# Altium project Drum_Water_Op3.PrjPcb (part 2 of 2)

## Sheet Power_Supply_AC_to_DC.SchDoc
size A; SheetNumber: 7; SheetTotal: 8
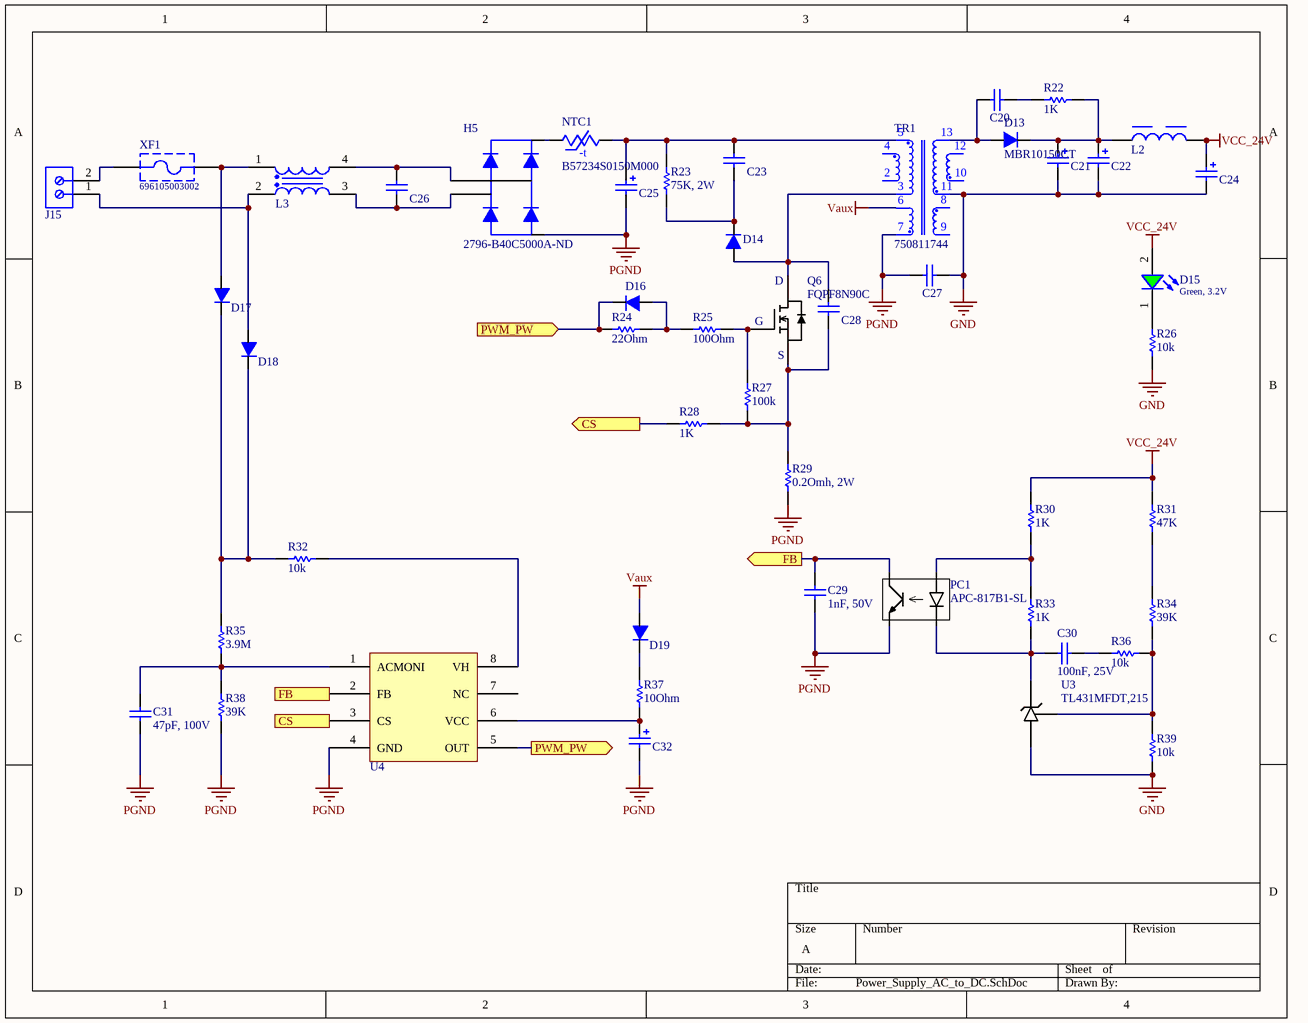
[diagram p6: Power_Supply_AC_to_DC.SchDoc]

### Parts
C20  1nF  [WCAP-CSMH_0805_L2W1.25H0.8_Reflow]  (value not drawn)
C21  1200uF  [WCAP-ATG8_D16H31.5]  (value not drawn)
C22  1200uF  [WCAP-ATG8_D16H31.5]  (value not drawn)
C23  4.7nF  [WCAP-CSMH_1206_L3.2W1.6H1.25]  (value not drawn)
C24  100uF  [WCAP-ATG8_D8H11.5]  (value not drawn)
C25  220uF  [WCAP-AI3H_D22H50]  (value not drawn)
C26  2.2uF  [WCAP-FTX2_L26W15H25]  (value not drawn)
C27  2.2nF  [WCAP-CSSA_2211_L5.7W2.8H2.5]  (value not drawn)
C28  22pF  [WCAP-CSMH_1210_L3.2W2.5H0.95]  (value not drawn)
C29  1nF, 50V  [WCAP-CSGP_0805_H=0.8mm_Reflow]
C30  100nF, 25V  [WCAP-CSGP_0805_H=0.8mm_Reflow]
C31  47pF, 100V  [WCAP-CSGP_0805_H=0.6mm_Reflow]
C32  10uF  [WCAP-ATG8_D5H11]  (value not drawn)
D13  MBR10150CT  [MBR10150CT]
D14  RS1M-13-F  [SMA]  (value not drawn)
D15  Green, 3.2V  [WL-SMCW_0603_H=0.7mm]
D16  CDBA360-HF  [SMA]  (value not drawn)
D17  RFU02VSM8STR  [Flat Lead]  (value not drawn)
D18  RFU02VSM8STR  [Flat Lead]  (value not drawn)
D19  RS1M-13-F  [SMA]  (value not drawn)
H5  2796-B40C5000A-ND  [GBJ-4]
J15  691137710002  [691137710002]  (value not drawn)
L2  10µH, 7A  [WE-LHMI_1040]  (value not drawn)
L3  13mH  [WE-FC_UT20V]  (value not drawn)
NTC1  B57234S0150M000  [NTC]
PC1  APC-817B1-SL  [APC-817B1-SL]
Q6  FQPF8N90C  [FQPF8N90C]
R22  value 1K  [RES-SM-2512]  (hidden comment: RK73H3ATTE10R0D)
R23  value 75K, 2W  [RES-SM-2512]  (hidden comment: 352175KFT)
R24  value 22Ohm  [RES-SM-0805]  (hidden comment: RK73H2ATTD22R0F)
R25  value 100Ohm  [RES-SM-0805]  (hidden comment: RK73B2ATTD101J)
R26  value 10k  [RES-SM-0805]  (hidden comment: RK73H2ATTD1002F)
R27  value 100k  [RES-SM-0805]  (hidden comment: RK73H2ATTD1003F)
R28  value 1K  [RES-SM-0805]  (hidden comment: RK73B2ATTD102J)
R29  value 0.2Omh, 2W  [RES-SM-2010]  (hidden comment: WFMB2010R2000FEA)
R30  value 1K  [RES-SM-0805]  (hidden comment: RK73B2ATTD102J)
R31  value 47K  [RES-SM-0805]  (hidden comment: RK73B2ATTD473J)
R32  value 10k  [RES-SM-0805]  (hidden comment: RK73H2ATTD1002F)
R33  value 1K  [RES-SM-0805]  (hidden comment: RK73B2ATTD102J)
R34  value 39K  [RES-SM-0805]  (hidden comment: RK73B2ATTD393J)
R35  value 3.9M  [RES-SM-0805]  (hidden comment: RK73B2ATTD395J)
R36  value 10k  [RES-SM-0805]  (hidden comment: RK73H2ATTD1002F)
R37  value 10Ohm  [RES-SM-0805]  (hidden comment: RK73H2ATTD10R0F)
R38  value 39K  [RES-SM-0805]  (hidden comment: RK73B2ATTD393J)
R39  value 10k  [RES-SM-0805]  (hidden comment: RK73H2ATTD1002F)
TR1  750811744  [750811744]
U3  TL431MFDT,215  [TO-236AB]
U4  BM1P061FJ-E2  [SOP-J8]  (value not drawn)
XF1  696105003002  [696105003002]

### Ports
CS (in), CS (out), FB (in), FB (out), PWM_PW (in), PWM_PW (out)

### Nets
GND: C21.2(N) C22.2(N) C24.2(N) C27.1 R26.2 R39.2 TR1.11 U3.3
PGND: C25.2(N) C27.2 C29.1 C31.1 C32.2(N) H5.4(-) PC1.3 R29.1 R38.1 TR1.7 U4.4(GND)
Vaux: D19.1(A) TR1.6
VCC_24V: C24.1(P) D15.2(A) L2.2 R30.1 R31.2
NetC20_1: C20.1 D13.1(A) TR1.13
NetC20_2: C20.2 R22.1
NetC21_1: C21.1(P) C22.1(P) D13.2(K) L2.1 R22.2
NetC23_1: C23.1 D14.2(K) R23.1
NetC23_2: C23.2 C25.1(P) NTC1.2 R23.2 TR1.5
NetC26_1: C26.1 H5.3 L3.3
NetC26_2: C26.2 H5.2 L3.4
NetC28_1: C28.1 Q6.3(S) R27.1 R28.1 R29.2
NetC28_2: C28.2 D14.1(A) Q6.2(D) TR1.3
NetC29_2: C29.2 PC1.4 U4.2(FB) ; port FB
NetC30_1: C30.1 PC1.2 R33.2 U3.1
NetC30_2: C30.2 R36.1
NetC31_2: C31.2 R35.1 R38.2 U4.1(ACMONI)
NetC32_1: C32.1(P) R37.1 U4.6(VCC)
NetD15_1: D15.1(K) R26.1
NetD16_1: D16.1(A) R24.2 R25.1
NetD16_2: D16.2(K) R24.1 U4.5(OUT) ; port PWM_PW
NetD17_1: D17.1(A) L3.1 XF1.2
NetD17_2: D17.2(K) D18.2(K) R32.2 R35.2
NetD18_1: D18.1(A) J15.1 L3.2
NetD19_2: D19.2(K) R37.2
NetH5_1: H5.1(+) NTC1.1
NetJ15_2: J15.2 XF1.1
NetPC1_1: PC1.1 R30.2 R33.1
NetQ6_1: Q6.1(G) R25.2 R27.2
NetR28_2: R28.2 U4.3(CS) ; port CS
NetR31_1: R31.1 R34.2
NetR32_1: R32.1 U4.8(VH)
NetR34_1: R34.1 R36.2 R39.1 U3.2

Not connected (* = marked no-connect by the designer): TR1 2 4 8 9 10 12; U4 7(NC)

### Notes on the sheet
- (in symbol NTC) -t

### Library data of the parts
C20 = 885342207013: WCAP-CSMH Multilayer Ceramic Chip Capacitor, Mid and High Voltage, size 0805, X7R Class II, 1nF, 500; Manufacturer: Wurth Elektronik; Case/Size Code: 0805; Capacitance Tolerance: 10%; Dissipation Factor: 2.5%; Insulation Resistance: 10GΩ; Rated Voltage (DC): 500V; Technical Reference: X7R0805102K500DFCT10000; No. Pad (SMD): 2; No. Pad (THT): 0; ComponentLink1Description: Website Link; ComponentLink1URL: https://www.we-online.com/redexpert/article/885342207013?ad; ComponentLink2Description: Datasheet Link; ComponentLink2URL: https://www.we-online.com/redexpert/spec/885342207013?ad; Manufacturer Part Number: 885342207013; Category: Multilayer Ceramic Chip Capacitors; Match Code: WCAP-CSMH; Mount: Surface Mount; Operating Temperature Max: 125°C; Operating Temperature Min: -55°C; Packaging: Tape and Reel; Length: 2mm; Width: 1.25mm; Height: 0.8mm; Capacitance: 1nF; Ceramic Type: X7R Class II; Unit Price (Digikey): 0.1
C21 C22 = 860010780025: WCAP-ATG8 Aluminum Electrolytic Capacitor, Radial THT, D16xH31.5mm, 1200uF, 63V; Manufacturer: Wurth Elektronik; Capacitance Tolerance: +/-20%; Dissipation Factor: 9%; Endurance: 2000h; Leakage Current: 756uA; Ripple Current: 1837mA; Technical Reference: ATBK315122M063DSPADB000; No. Pad (SMD): 0; No. Pad (THT): 2; ComponentLink1Description: Manufacturer Link; ComponentLink1URL: https://www.we-online.com/redexpert/article/860010780025?ad; ComponentLink2Description: Datasheet; ComponentLink2URL: https://www.we-online.com/redexpert/spec/860010780025?ad; Category: Aluminum Electrolytic Capacitors; Match Code: WCAP-ATG8; Manufacturer Part Number: 860010780025; Mount: Through Hole; Operating Temperature Max: 85°C; Operating Temperature Min: -40°C; Packaging: Ammo Pack; Height: 31.5mm; Diameter: 16mm; Capacitance: 1200uF; Rated Voltage (DC): 63V; Unit Price (Digikey): 2.81
C23 = 885342208008: WCAP-CSMH Multilayer Ceramic Chip Capacitor, Mid and High Voltage, size 1206, X7R Class II, 4.7nF, 5; Manufacturer: Wurth Elektronik; Case/Size Code: 1206; Capacitance Tolerance: 10%; Dissipation Factor: 2.5%; Insulation Resistance: 10GΩ; Rated Voltage (DC): 500V; Technical Reference: X7R1206472K500DFCT10000; No. Pad (SMD): 2; No. Pad (THT): 0; ComponentLink1Description: Website Link; ComponentLink1URL: https://www.we-online.com/redexpert/article/885342208008?ad; ComponentLink2Description: Datasheet Link; ComponentLink2URL: https://www.we-online.com/redexpert/spec/885342208008?ad; Manufacturer Part Number: 885342208008; Category: Multilayer Ceramic Chip Capacitors; Match Code: WCAP-CSMH; Mount: Surface Mount; Operating Temperature Max: 125°C; Operating Temperature Min: -55°C; Packaging: Tape and Reel; Length: 3.2mm; Width: 1.6mm; Height: 1.25mm; Capacitance: 4.7nF; Ceramic Type: X7R Class II; Unit Price (Digikey): 0.14
C24 = 860010674014: WCAP-ATG8 Aluminum Electrolytic Capacitor, Radial THT, D8xH11.5mm, 100uF, 50V; Manufacturer: Wurth Elektronik; Capacitance Tolerance: +/-20%; Dissipation Factor: 10%; Endurance: 2000h; Leakage Current: 50uA; Ripple Current: 286mA; Technical Reference: ATBE115101M050DSPA7B000; No. Pad (SMD): 0; No. Pad (THT): 2; ComponentLink1Description: Manufacturer Link; ComponentLink1URL: https://www.we-online.com/redexpert/article/860010674014?ad; ComponentLink2Description: Datasheet; ComponentLink2URL: https://www.we-online.com/redexpert/spec/860010674014?ad; Category: Aluminum Electrolytic Capacitors; Match Code: WCAP-ATG8; Manufacturer Part Number: 860010674014; Mount: Through Hole; Operating Temperature Max: 85°C; Operating Temperature Min: -40°C; Packaging: Ammo Pack; Height: 11.5mm; Diameter: 8mm; Capacitance: 100uF; Rated Voltage (DC): 50V; Unit Price (Digikey): 0.28
C25 = 861141483007: WCAP-AI3H Aluminum Electrolytic Capacitor, Snap-In, D22xH50mm, 220uF, 450V; Manufacturer: Wurth Elektronik; Capacitance Tolerance: +/-20%; Dissipation Factor: 20%; Endurance: 3000h; Leakage Current: 943.93uA; Ripple Current: 1000mA; Technical Reference: ANJN500221M450DSIC3C000; No. Pad (SMD): 0; No. Pad (THT): 2; ComponentLink1Description: Manufacturer Link; ComponentLink1URL: https://www.we-online.com/redexpert/article/861141483007?ad; ComponentLink2Description: Datasheet; ComponentLink2URL: https://www.we-online.com/redexpert/spec/861141483007?ad; Category: Aluminum Electrolytic Capacitors; Match Code: WCAP-AI3H; Manufacturer Part Number: 861141483007; Mount: Through Hole; Operating Temperature Max: 105°C; Operating Temperature Min: -25°C; Packaging: Tray; Height: 50mm; Diameter: 22mm; Capacitance: 220uF; Rated Voltage (DC): 450V; Unit Price (Digikey): 9.35
C26 = 890324026034: WCAP-FTX2 Film Capacitor, THT, L26W15H25mm, 2.2uF, 275VAC; Manufacturer: Wurth Elektronik; Capacitance Tolerance: +/-10%; Dissipation Factor @1kHz: 0.1%; Dissipation Factor @10kHz: 0.7%; Insulation Resistance: 10000Ohm x F; Pitch: 22.5mm; Rate of Voltage Rise: 170V/us; Rated Voltage (AC): 275V; Technical Reference: MX2P225225K275ASPB46000; No. Pad (SMD): 0; No. Pad (THT): 2; ComponentLink1Description: Manufacturer Link; ComponentLink1URL: https://www.we-online.com/redexpert/article/890324026034?ad; ComponentLink2Description: Datasheet; ComponentLink2URL: https://www.we-online.com/redexpert/spec/890324026034?ad; Category: Film Capacitors; Match Code: WCAP-FTX2; Manufacturer Part Number: 890324026034; Mount: Through Hole; Operating Temperature Max: 105°C; Operating Temperature Min: -40°C; Packaging: Carton; Length: 26mm; Width: 15mm; Height: 25mm; Capacitance: 2.2uF; Unit Price (Digikey): 3.2
C27 = 8853522130151: WCAP-CSSA Multilayer Ceramic Chip Safety Capacitor, 2211, X7R Class II, X1/Y2, 2.2nF, 250VAC; Manufacturer: Wurth Elektronik; Case/Size Code: 2211; Capacitance Tolerance: +/-10%; Dissipation Factor: 2.5%; Impulse Voltage: 5000VDC; Insulation Resistance: 10GOhm; Rated Voltage (AC): 250V; Technical Reference: X7R2211222KE00IFCT1B000; No. Pad (SMD): 2; No. Pad (THT): 0; ComponentLink1Description: Manufacturer Link; ComponentLink1URL: https://www.we-online.com/redexpert/article/8853522130151?ad; ComponentLink2Description: Datasheet; ComponentLink2URL: https://www.we-online.com/redexpert/spec/8853522130151?ad; Category: Multilayer Ceramic Chip Capacitors; Match Code: WCAP-CSSA; Manufacturer Part Number: 8853522130151; Mount: Surface Mount; Operating Temperature Max: 125°C; Operating Temperature Min: -55°C; Packaging: Tape and Reel; Length: 5.7mm; Width: 2.8mm; Height: 2.5mm; Capacitance: 2.2nF; Ceramic Type: X7R Class II; Safety Class: X1/Y2; Unit Price (Digikey): 3.04
C28 = 885342009002: WCAP-CSMH Multilayer Ceramic Chip Capacitor, Mid and High Voltage, size 1210, NP0 Class I, 22pF, 100; Manufacturer: Wurth Elektronik; Case/Size Code: 1210; Capacitance Tolerance: 5%; Insulation Resistance: 10GΩ; Q Factor: 840; Rated Voltage (DC): 1000V; Technical Reference: NP01210220JA00DFCT10000; No. Pad (SMD): 2; No. Pad (THT): 0; ComponentLink1Description: Website Link; ComponentLink1URL: https://www.we-online.com/redexpert/article/885342009002?ad; ComponentLink2Description: Datasheet Link; ComponentLink2URL: https://www.we-online.com/redexpert/spec/885342009002?ad; Manufacturer Part Number: 885342009002; Category: Multilayer Ceramic Chip Capacitors; Match Code: WCAP-CSMH; Mount: Surface Mount; Operating Temperature Max: 125°C; Operating Temperature Min: -55°C; Packaging: Tape and Reel; Length: 3.2mm; Width: 2.5mm; Height: 0.95mm; Capacitance: 22pF; Ceramic Type: NP0 Class I; Unit Price (Digikey): 0.85
C29 = 885012007063: WCAP-CSGP Multilayer Ceramic Chip Capacitor, General Purpose, size 0805, NP0, 1nF, 50V; Manufacturer: Wurth Elektronik; Rated Voltage: 50VDC; Isolation Resistance: >=10GOhm; Capacitance Tolerance: +/-5%; Dissipation Factor: Q>=1000; Technical Reference: NP00805102J050DFCT10000; No. Pad (SMD): 2; No. Pad (THT): 0; ComponentLink1Description: Manufacturer; ComponentLink1URL: http://www.we-online.de; ComponentLink2Description: Datasheet; ComponentLink2URL: https://www.we-online.com/catalog/datasheet/885012007063.pdf; Operating Temperature: -55 to +125degC; Packaging: Tape and Reel; Manufacturer Part Number: 885012007063; Published Date: May 2020; Ceramic Type: NP0; Height: 0.8mm; Mounting Technology: SMT; Size: 0805; Capacitance: 1nF; Unit Price (Digikey): 0.1
C30 = 885012207072: WCAP-CSGP Multilayer Ceramic Chip Capacitor, General Purpose, size 0805, X7R, 100nF, 25V; Manufacturer: Wurth Elektronik; Rated Voltage: 25VDC; Isolation Resistance: >=5GOhm; Capacitance Tolerance: +/-10%; Technical Reference: X7R0805104K025DFCT10000; No. Pad (SMD): 2; No. Pad (THT): 0; ComponentLink1Description: Manufacturer; ComponentLink1URL: http://www.we-online.de; ComponentLink2Description: Datasheet; ComponentLink2URL: https://www.we-online.com/catalog/datasheet/885012207072.pdf; Operating Temperature: -55 to +125degC; Packaging: Tape and Reel; Manufacturer Part Number: 885012207072; Published Date: May 2020; Ceramic Type: X7R; Dissipation Factor: =<3.5%; Height: 0.8mm; Mounting Technology: SMT; Size: 0805; Capacitance: 100nF; Unit Price (Digikey): 0.1
C31 = 885012007080: WCAP-CSGP Multilayer Ceramic Chip Capacitor, General Purpose, size 0805, NP0, 47pF, 100V; Manufacturer: Wurth Elektronik; Rated Voltage: 100VDC; Isolation Resistance: >=10GOhm; Capacitance Tolerance: +/-5%; Dissipation Factor: Q>=1000; Technical Reference: NP00805470J100DFCT10000; No. Pad (SMD): 2; No. Pad (THT): 0; ComponentLink1Description: Manufacturer; ComponentLink1URL: http://www.we-online.de; ComponentLink2Description: Datasheet; ComponentLink2URL: https://www.we-online.com/catalog/datasheet/885012007080.pdf; Operating Temperature: -55 to +125degC; Packaging: Tape and Reel; Manufacturer Part Number: 885012007080; Published Date: May 2020; Ceramic Type: NP0; Height: 0.6mm; Mounting Technology: SMT; Size: 0805; Capacitance: 47pF; Unit Price (Digikey): 0.1
C32 = 860010672009: WCAP-ATG8 Aluminum Electrolytic Capacitor, Radial THT, D5xH11mm, 10uF, 50V; Manufacturer: Wurth Elektronik; Capacitance Tolerance: +/-20%; Dissipation Factor: 10%; Endurance: 2000h; Leakage Current: 5uA; Ripple Current: 72mA; Technical Reference: ATBC110100M050DSPA3B000; No. Pad (SMD): 0; No. Pad (THT): 2; ComponentLink1Description: Manufacturer Link; ComponentLink1URL: https://www.we-online.com/redexpert/article/860010672009?ad; ComponentLink2Description: Datasheet; ComponentLink2URL: https://www.we-online.com/redexpert/spec/860010672009?ad; Category: Aluminum Electrolytic Capacitors; Match Code: WCAP-ATG8; Manufacturer Part Number: 860010672009; Mount: Through Hole; Operating Temperature Max: 85°C; Operating Temperature Min: -40°C; Packaging: Ammo Pack; Height: 11mm; Diameter: 5mm; Capacitance: 10uF; Rated Voltage (DC): 50V; Unit Price (Digikey): 0.12
D13 = Diode: DIODE ARRAY SCHOTTKY 150V TO220; Mfr: SMC Diode Solutions; Diode Configuration: 1 Pair Common Cathode; Current - Average Rectified (Io) (per Diode): 5A; Voltage - Forward (Vf) (Max) @ If: 930 mV @ 5 A; Speed: Fast Recovery =< 500ns, > 200mA (Io); Current - Reverse Leakage @ Vr: 1 mA @ 150 V; No. Pad (SMD): 0; No. Pad (THT): 3; Category: Discrete Semiconductor Products; Diode Type: Schottky; Voltage - DC Reverse (Vr) (Max): 150 V; Operating Temperature - Junction: -55°C ~ 150°C; Mounting Type: Through Hole; Package / Case: TO-220-3; Supplier Device Package: TO-220AB; Base Product Number: MBR10150; Unit Price (Digikey): 0.74
D14 D19 = Diode: DIODE GEN PURP 1KV 1A SMA; Mfr: Diodes Incorporated; Diode Type: Standard; Voltage - DC Reverse (Vr) (Max): 1000V; Voltage - Forward (Vf) (Max) @ If: 1.3 V @ 1 A; Speed: Fast Recovery =< 500ns, > 200mA (Io); Reverse Recovery Time (trr): 500 ns; Current - Reverse Leakage @ Vr: 5 µA @ 1000 V; Capacitance @ Vr, F: 15pF @ 4V, 1MHz; Base Product Number: RS1M; No. Pad (SMD): 2; No. Pad (THT): 0; Category: Discrete Semiconductor Products; Current - Average Rectified (Io): 1A; Mounting Type: Surface Mount; Package / Case: DO-214AC, SMA; ComponentLink1Description: Digikey; ComponentLink1URL: https://www.digikey.com/en/products/detail/diodes-incorporated/RS1M-13-F/775742?s=N4IgTCBcDaIEoGUCMBZAtEgzGgYiAugL5A; Unit Price (Digikey): 0.5
D15 = 150060GS75000: WL-SMCW SMT Mono-color Chip LED Waterclear, size 0603, Green, 3.2V, 140deg; Chip Technology: InGaN; Dominant Wavelength typ.: 525nm; Luminous Intensity typ.: 430mcd; Peak Wavelength typ.: 515nm; No. Pad (SMD): 2; No. Pad (THT): 0; Viewing Angle: 140deg; ComponentLink1Description: Manufacturer; ComponentLink1URL: http://www.we-online.de; ComponentLink2URL: https://www.we-online.com/catalog/datasheet/150060GS75000.pdf; ComponentLink2Description: Datasheet; Forward Voltage typ.: 3.2V; Emitting Color: Green; Mounting Technology: SMT; Operating Temperature: -40 to +85degC; Published Date: December 2019; Part Number: 150060GS75000; Packaging: Tape and Reel; Size: 0603; Publisher: Wurth Elektronik; Unit Price (Digikey): 0.15
D16 = Diode: DIODE SCHOTTKY 60V 3A DO214AC; Mfr: Comchip Technology; Voltage - Forward (Vf) (Max) @ If: 700 mV @ 3 A; Speed: Fast Recovery =< 500ns, > 200mA (Io); Current - Reverse Leakage @ Vr: 500 µA @ 60 V; Capacitance @ Vr, F: 250pF @ 4V, 1MHz; No. Pad (SMD): 2; No. Pad (THT): 0; Category: Discrete Semiconductor Products; Diode Type: Schottky; ComponentLink1Description: Digikey; ComponentLink1URL: https://www.digikey.com/en/products/detail/comchip-technology/CDBA360-HF/5226173; Voltage - DC Reverse (Vr) (Max): 60 V; Current - Average Rectified (Io): 3A; Package / Case: DO-214AC, SMA; Operating Temperature - Junction: -50°C ~ 150°C; Base Product Number: CDBA360; Unit Price (Digikey): 0.39
D17 D18 = Diode: DIODE GP 800V 200MA TUMD2SM; Mfr: Rohm Semiconductor; Diode Type: Standard; Voltage - Forward (Vf) (Max) @ If: 3 V @ 200 mA; Speed: Small Signal =< 200mA (Io), Any Speed; Reverse Recovery Time (trr): 25 ns; Current - Reverse Leakage @ Vr: 10 µA @ 800 V; Capacitance @ Vr, F: 4pF @ 0V, 1MHz; Base Product Number: RFU02; No. Pad (SMD): 2; No. Pad (THT): 0; Category: Discrete Semiconductor Products; Voltage - DC Reverse (Vr) (Max): 800 V; Current - Average Rectified (Io): 200mA; ComponentLink1Description: Digikey; ComponentLink1URL: https://www.digikey.com/en/products/detail/rohm-semiconductor/RFU02VSM8STR/5113962; Mounting Type: Surface Mount; Package / Case: 2-SMD, Flat Lead; Operating Temperature - Junction: 150°C (Max); Unit Price (Digikey): 0.44
H5 = H Bridge: Bridge Rectifier Single Phase Standard 80 V Through Hole 4-SIP; Voltage - Peak Reverse (Max): 80 V; Current - Average Rectified (Io): 4 A; Voltage - Forward (Vf) (Max) @ If: 1 V @ 5 A; Current - Reverse Leakage @ Vr: 5 µA @ 80 V; No. Pad (SMD): 0; No. Pad (THT): 4; Diode Type: Single Phase; Technology: Standard; Operating Temperature: -50°C ~ 150°C (TJ); Mounting Type: Through Hole; Package / Case: 4-SIP; Supplier Device Package: 4-SIP; ComponentLink1Description: Digikey; ComponentLink1URL: https://www.digikey.com/en/products/detail/diotec-semiconductor/B40C5000A/13155422; Unit Price (Digikey): 1.36
J15 = 691137710002: WR-TBL Series 1377 Horizontal Entry, Through Hole, pitch 5mm, 2p; Manufacturer: Wurth Elektronik; Pin Number: 2; Rated Current: 16A; Working Voltage: 300V; PCB/Cable/Panel: PCB; Modularity: No; No. Pad (SMD): 0; ComponentLink1Description: Manufacturer Link; ComponentLink1URL: https://www.we-online.com/redexpert/article/691137710002?ad; ComponentLink2Description: Datasheet; ComponentLink2URL: https://www.we-online.com/redexpert/spec/691137710002?ad; Category: Terminal Blocks; Match Code: WR-TBL; Manufacturer Part Number: 691137710002; Mount: Through Hole; Operating Temperature Max: 120°C; Operating Temperature Min: -30°C; Packaging: Box; Pitch: 5mm; Orientation: Horizontal; Application: Pressure Clamp; No. Pad (THT): 2; Unit Price (Digikey): 0.41
L2 = 74437368100: WE-LHMI SMT Power Inductor, size 1040, 10µH, 7A, 30mΩ; Manufacturer: Wurth Elektronik; Case/Size Code: 1040; DC Resistance: 27mΩ; Saturation Current @10%: 7.9A; Saturation Current @30%: 16.8A; Self Resonant Frequency: 12MHz; No. Pad (SMD): 2; No. Pad (THT): 0; ComponentLink1Description: Website Link; ComponentLink1URL: https://www.we-online.com/redexpert/article/74437368100?ad; ComponentLink2Description: Datasheet Link; ComponentLink2URL: https://www.we-online.com/redexpert/spec/74437368100?ad; Manufacturer Part Number: 74437368100; Category: Shielded Power Inductors; Match Code: WE-LHMI; Mount: Surface Mount; Operating Temperature Max: 125°C; Operating Temperature Min: -40°C; Packaging: Tape and Reel; Length: 10mm; Width: 10mm; Height: 3.8mm; DC Resistance Max: 30mΩ; Inductance: 10µH; Performance Rated Current: 7A; Unit Price (Digikey): 2.57
L3 = 7448640415: WE-FC THT Common Mode Power Line Choke, UT20V, 13mH, 0.8A, 0.708Ω; Manufacturer: Wurth Elektronik; Insulation Test Voltage (AC): 2000V; Material: MnZn; Rated Voltage (AC): 250V; No. Pad (SMD): 0; No. Pad (THT): 4; ComponentLink1Description: Website Link; ComponentLink1URL: https://www.we-online.com/redexpert/article/7448640415?ad; ComponentLink2Description: Datasheet Link; ComponentLink2URL: https://www.we-online.com/redexpert/spec/7448640415?ad; Manufacturer Part Number: 7448640415; Category: Common Mode Chokes; Match Code: WE-FC; Mount: Through Hole; Operating Temperature Max: 125°C; Operating Temperature Min: -40°C; Packaging: Tray; Case/Size Code: UT20V; Length: 21.3mm; Width: 16.6mm; Height: 22.5mm; DC Resistance: 0.708Ω; Inductance: 13mH; Rated Current: 0.8A; Unit Price (Digikey): 2.07
NTC1 = NTC: THERMISTOR NTC 15OHM 3000K; Mfr: EPCOS - TDK Electronics; Product Status: Active; R @ 25°C: 15 Ohms; Tolerance: ±20%; Current - Steady State Max: 4 A; Approval Agency: UL; No. Pad (SMD): 0; No. Pad (THT): 2; Category: Circuit Protection; Series: S234; Package: Bulk; Diameter: 0.591" (15.00mm); Lead Spacing: 0.295" (7.50mm); ComponentLink1Description: New link; ComponentLink1URL: *; Unit Price (Digikey): 2.1
PC1 = Opto Isolator: DIP4, DC INPUT, PHOTO TRANSISTOR; Mfr: American Bright Optoelectronics Corporation; Number of Channels: 1; Voltage - Isolation: 5000Vrms; Current Transfer Ratio (Min): 130% @ 5mA; Current Transfer Ratio (Max): 260% @ 5mA; Rise / Fall Time (Typ): 3µs, 4µs; Voltage - Output (Max): 35V; Current - Output / Channel: 50mA; Voltage - Forward (Vf) (Typ): 1.24V; Current - DC Forward (If) (Max): 60 mA; Vce Saturation (Max): 200mV; No. Pad (SMD): 4; No. Pad (THT): 0; Category: Isolators; Series: APC-817; Input Type: DC; Output Type: Transistor; Operating Temperature: -55°C ~ 110°C; Package / Case: 4-SMD, Gull Wing; Base Product Number: APC-817; ComponentLink1Description: Digikey; ComponentLink1URL: https://www.digikey.com/en/products/detail/american-bright-optoelectronics-corporation/APC-817B1-SL/16273138?s=N4IgTCBcDaIIIAUDCAOAjAdgLQCE1YGUAZEAXQF8g; Unit Price (Digikey): 0.45
Q6 = Mosfet: MOSFET N-CH 900V 6.3A TO220F; Mfr: onsemi; FET Type: N-Channel; Current - Continuous Drain (Id) @ 25°C: 6.3A (Tc); Drive Voltage (Max Rds On, Min Rds On): 10V; Rds On (Max) @ Id, Vgs: 1.9Ohm @ 3.15A, 10V; Vgs(th) (Max) @ Id: 5V @ 250µA; Gate Charge (Qg) (Max) @ Vgs: 45 nC @ 10 V; Vgs (Max): ±30V; Input Capacitance (Ciss) (Max) @ Vds: 2080 pF @ 25 V; Power Dissipation (Max): 60W (Tc); Base Product Number: FQPF8; No. Pad (SMD): 0; No. Pad (THT): 3; Technology: MOSFET (Metal Oxide); Drain to Source Voltage (Vdss): 900 V; Operating Temperature: -55°C ~ 150°C (TJ); Mounting Type: Through Hole; Supplier Device Package: TO-220F-3; Package / Case: TO-220-3 Full Pack; Unit Price (Digikey): 3.52
R22 = RESISTOR SMD: RES 10 OHM 0.5% 1W 2512; Mfr: KOA Speer Electronics, Inc.; Resistance: 10 Ohms; Temperature Coefficient: ±100ppm/°C; No. Pad (SMD): 2; No. Pad (THT): 0; Category: Resistors; Series: RK73H; Tolerance: ±0.5%; Power (Watts): 1W; Composition: Thick Film; Features: Automotive AEC-Q200, Moisture Resistant; Operating Temperature: -55°C ~ 155°C; Package / Case: 2512 (6432 Metric); Ratings: AEC-Q200; Size / Dimension: 0.248" L x 0.122" W (6.30mm x 3.10mm); Base Product Number: RK73H3A; ComponentLink1Description: Digikey; ComponentLink1URL: https://www.digikey.com/en/products/detail/koa-speer-electronics-inc/RK73H3ATTE10R0D/10431990; Unit Price (Digikey): 0.13
R23 = RESISTOR SMD: RES SMD 75K OHM 1% 2W 2512; Mfr: TE Connectivity Passive Product; Resistance: 75 kOhms; Temperature Coefficient: ±100ppm/°C; No. Pad (SMD): 2; No. Pad (THT): 0; Category: Resistors; Series: 3521, CGS; Tolerance: ±1%; Power (Watts): 2W; Composition: Thick Film; Features: Automotive AEC-Q200; Operating Temperature: -55°C ~ 155°C; Package / Case: 2512 (6432 Metric); Ratings: AEC-Q200; Size / Dimension: 0.248" L x 0.126" W (6.30mm x 3.20mm); Height - Seated (Max): 0.026" (0.65mm); ComponentLink1Description: Digikey; ComponentLink1URL: https://www.digikey.com/en/products/detail/te-connectivity-passive-product/352175KFT/4279980?s=N4IgTCBcDaIMwFYwEYDsCDSAxAKiAugL5A; Unit Price (Digikey): 0.59
R24 = RESISTOR SMD: RES 22 OHM 1% 1/4W 0805; Mfr: KOA Speer Electronics, Inc.; Resistance: 22 Ohms; Power (Watts): 0.25W, 1/4W; Temperature Coefficient: ±100ppm/°C; No. Pad (SMD): 2; No. Pad (THT): 0; Category: Resistors; Series: RK73H; Tolerance: ±1%; Composition: Thick Film; Features: Automotive AEC-Q200, Moisture Resistant; Operating Temperature: -55°C ~ 155°C; ComponentLink1Description: Digikey; ComponentLink1URL: https://www.digikey.com/en/products/detail/koa-speer-electronics-inc/RK73H2ATTD22R0F/10234130?s=N4IgTCBcDaIEoGkDsBmAEmAggFWwETDDgAYAxEAXQF8g; Package / Case: 0805 (2012 Metric); Ratings: AEC-Q200; Size / Dimension: 0.079" L x 0.049" W (2.00mm x 1.25mm); Base Product Number: RK73H2A; Unit Price (Digikey): 0.1
R25 = RESISTOR SMD: RES 100 OHM 5% 1/4W 0805; Mfr: KOA Speer Electronics, Inc.; Resistance: 100 Ohms; Power (Watts): 0.25W, 1/4W; Temperature Coefficient: ±200ppm/°C; No. Pad (SMD): 2; No. Pad (THT): 0; Category: Resistors; ComponentLink1Description: Digikey; ComponentLink1URL: https://www.digikey.com/en/products/detail/koa-speer-electronics-inc/RK73B2ATTD101J/10236510?s=N4IgTCBcDaIE4GsDsBmARmAhgF2wEwEYAGAgKxAF0BfIA; Series: RK73B; Tolerance: ±5%; Composition: Thick Film; Features: Automotive AEC-Q200; Operating Temperature: -55°C ~ 155°C; Package / Case: 0805 (2012 Metric); Size / Dimension: 0.079" L x 0.049" W (2.00mm x 1.25mm); Base Product Number: RK73B2A; Unit Price (Digikey): 0.1
R26 R32 R36 R39 = RESISTOR SMD: RES 10K OHM 1% 1/4W 0805; Mfr: KOA Speer Electronics, Inc.; Resistance: 10 kOhms; Power (Watts): 0.25W, 1/4W; Temperature Coefficient: ±100ppm/°C; No. Pad (SMD): 2; No. Pad (THT): 0; Category: Resistors; Series: RK73H; Tolerance: ±1%; Composition: Thick Film; Features: Automotive AEC-Q200, Moisture Resistant; Operating Temperature: -55°C ~ 155°C; Package / Case: 0805 (2012 Metric); Size / Dimension: 0.079" L x 0.049" W (2.00mm x 1.25mm); Base Product Number: RK73H2A; ComponentLink1Description: Digikey; ComponentLink1URL: https://www.digikey.com/en/products/detail/koa-speer-electronics-inc/RK73H2ATTD1002F/10234111; Unit Price (Digikey): 0.1
R27 = RESISTOR SMD: RES 100K OHM 1% 1/4W 0805; Mfr: KOA Speer Electronics, Inc.; Resistance: 100 kOhms; Power (Watts): 0.25W, 1/4W; Temperature Coefficient: ±100ppm/°C; No. Pad (SMD): 2; No. Pad (THT): 0; Series: RK73H; Tolerance: ±1%; Composition: Thick Film; Features: Automotive AEC-Q200, Moisture Resistant; Operating Temperature: -55°C ~ 155°C; Package / Case: 0805 (2012 Metric); Supplier Device Package: 0805; Ratings: AEC-Q200; Size / Dimension: 0.079" L x 0.049" W (2.00mm x 1.25mm); Height - Seated (Max): 0.024" (0.60mm); Number of Terminations: 2; Base Product Number: RK73H2A; ComponentLink1Description: Digikey; ComponentLink1URL: https://www.digikey.com/en/products/detail/koa-speer-electronics-inc/RK73H2ATTD1003F/10234279; Unit Price (Digikey): 0.1
R28 R30 R33 = RESISTOR SMD: RES 1K OHM 5% 1/4W 0805; Mfr: KOA Speer Electronics, Inc.; Resistance: 1 kOhms; Power (Watts): 0.25W, 1/4W; Temperature Coefficient: ±200ppm/°C; Base Product Number: RK73H2A; No. Pad (SMD): 2; No. Pad (THT): 0; Category: Resistors; Series: RK73H; Tolerance: ±5%; Composition: Thick Film; Features: Automotive AEC-Q200, Moisture Resistant; Operating Temperature: -55°C ~ 155°C; Package / Case: 0805 (2012 Metric); Size / Dimension: 0.079" L x 0.049" W (2.00mm x 1.25mm); ComponentLink1Description: Digikey; ComponentLink1URL: https://www.digikey.com/en/products/detail/koa-speer-electronics-inc/RK73H2ATTD1002F/10234111; Unit Price (Digikey): 0.1
R29 = RESISTOR SMD: RES 0.2 OHM 2.0 W 1% 2010 SMD; Mfr: Vishay Dale; Resistance: 200 mOhms; Power (Watts): 2W; Temperature Coefficient: ±50ppm/°C; No. Pad (SMD): 2; No. Pad (THT): 0; Category: Resistors; Series: WFM; Tolerance: ±1%; Composition: Metal Film; Features: Automotive AEC-Q200, Current Sense, Moisture Resistant; Operating Temperature: -65°C ~ 170°C; Package / Case: 2010 (5025 Metric); Size / Dimension: 0.200" L x 0.100" W (5.08mm x 2.54mm); ComponentLink1Description: Digikey; ComponentLink1URL: https://www.digikey.com/en/products/detail/vishay-dale/WFMB2010R2000FEA/9972271?s=N4IgTCBcDaIOoDECyAhMAGAjOgSh96CAogIIgC6AvkA; Unit Price (Digikey): 1.33
R31 = RESISTOR SMD: RES 47K OHM 5% 1/4W 0805; Mfr: KOA Speer Electronics, Inc.; Resistance: 47 kOhms; Power (Watts): 0.25W, 1/4W; Temperature Coefficient: ±400ppm/°C; No. Pad (SMD): 2; No. Pad (THT): 0; Category: Resistors; Series: RK73B; Tolerance: ±5%; Composition: Thick Film; Features: Automotive AEC-Q200; Operating Temperature: -55°C ~ 155°C; Package / Case: 0805 (2012 Metric); Ratings: AEC-Q200; Size / Dimension: 0.079" L x 0.049" W (2.00mm x 1.25mm); Height - Seated (Max): 0.024" (0.60mm); Base Product Number: RK73B2A; ComponentLink1Description: Digikey; ComponentLink1URL: https://www.digikey.com/en/products/detail/koa-speer-electronics-inc/RK73B2ATTD395J/10236524; Unit Price (Digikey): 0.1
R34 R38 = RESISTOR SMD: RES 39K OHM 5% 1/4W 0805; Mfr: KOA Speer Electronics, Inc.; Resistance: 39 KOhms; Power (Watts): 0.25W, 1/4W; Temperature Coefficient: ±400ppm/°C; No. Pad (SMD): 2; No. Pad (THT): 0; Category: Resistors; Series: RK73B; Tolerance: ±5%; Composition: Thick Film; Features: Automotive AEC-Q200; Operating Temperature: -55°C ~ 155°C; Package / Case: 0805 (2012 Metric); Ratings: AEC-Q200; Size / Dimension: 0.079" L x 0.049" W (2.00mm x 1.25mm); Height - Seated (Max): 0.024" (0.60mm); Base Product Number: RK73B2A; ComponentLink1Description: Digikey; ComponentLink1URL: https://www.digikey.com/en/products/detail/koa-speer-electronics-inc/RK73B2ATTD395J/10236524; Unit Price (Digikey): 0.1
R35 = RESISTOR SMD: RES 3.9M OHM 5% 1/4W 0805; Mfr: KOA Speer Electronics, Inc.; Resistance: 3.9 MOhms; Power (Watts): 0.25W, 1/4W; Temperature Coefficient: ±400ppm/°C; No. Pad (SMD): 2; No. Pad (THT): 0; Category: Resistors; Series: RK73B; Tolerance: ±5%; Composition: Thick Film; Features: Automotive AEC-Q200; Operating Temperature: -55°C ~ 155°C; Package / Case: 0805 (2012 Metric); Ratings: AEC-Q200; Size / Dimension: 0.079" L x 0.049" W (2.00mm x 1.25mm); Height - Seated (Max): 0.024" (0.60mm); Base Product Number: RK73B2A; ComponentLink1Description: Digikey; ComponentLink1URL: https://www.digikey.com/en/products/detail/koa-speer-electronics-inc/RK73B2ATTD395J/10236524; Unit Price (Digikey): 0.1
R37 = RESISTOR SMD: RES 10 OHM 1% 1/4W 0805; Mfr: KOA Speer Electronics, Inc.; Resistance: 10 Ohms; Power (Watts): 0.25W, 1/4W; Temperature Coefficient: ±100ppm/°C; No. Pad (SMD): 2; No. Pad (THT): 0; Category: Resistors; Series: RK73H; Tolerance: ±1%; Composition: Thick Film; Features: Automotive AEC-Q200, Moisture Resistant; Operating Temperature: -55°C ~ 155°C; Package / Case: 0805 (2012 Metric); Ratings: AEC-Q200; Size / Dimension: 0.079" L x 0.049" W (2.00mm x 1.25mm); Height - Seated (Max): 0.024" (0.60mm); Base Product Number: RK73H2A; ComponentLink1Description: Digikey; ComponentLink1URL: https://www.digikey.com/en/products/detail/koa-speer-electronics-inc/RK73H2ATTD10R0F/10234071; Unit Price (Digikey): 0.1
TR1 = 750811744: Flyback Converters For For DC/DC Converters SMPS Transformer 4000Vrms Isolation 80kHz Through Hole; Mfr: Würth Elektronik; Inductance @ Frequency: 450µH @ 10kHz; Voltage - Auxiliary: 14V @ 50mA; Voltage - Primary: 90 ~ 375V; No. Pad (SMD): 0; No. Pad (THT): 14; Height - Seated (Max): 1.200" (30.48mm); Size / Dimension: 1.559" L x 1.700" W (39.60mm x 43.18mm); Mounting Type: Through Hole; Frequency: 80kHz; Operating Temperature: -40°C ~ 125°C; Voltage - Isolation: 4000Vrms; Applications: Flyback Converters; Type: For DC/DC Converters; Package: Tray; Series: MID-OLON; Category: Transformers; Unit Price (Digikey): 9.17
U3 = IC Shunt: IC VREF SHUNT ADJ 2% TO236AB; Mfr: Nexperia USA Inc.; Output Type: Adjustable; Voltage - Output (Min/Fixed): 2.495V; Voltage - Output (Max): 36 V; Current - Output: 100 mA; Current - Cathode: 1 mA; Base Product Number: TL431; No. Pad (SMD): 3; No. Pad (THT): 0; Category: Integrated Circuits (ICs); Reference Type: Shunt; Tolerance: ±2%; Operating Temperature: -40°C ~ 125°C (TA); Mounting Type: Surface Mount; Package / Case: TO-236-3, SC-59, SOT-23-3; ComponentLink1Description: Digikey; ComponentLink1URL: https://www.digikey.com/en/products/detail/nexperia-usa-inc/TL431MFDT-215/2780405; Unit Price (Digikey): 0.41
U4 = IC PWM: IC OFFLINE SWITCH FLYBACK 8SOPJ; Mfr: Rohm Semiconductor; Output Isolation: Either; Internal Switch(s): No; Voltage - Start Up: 13.5 V; Voltage - Supply (Vcc/Vdd): 8.9V ~ 26V; Duty Cycle: 75%; Frequency - Switching: 65kHz; Fault Protection: Current Limiting, Over Voltage; No. Pad (SMD): 8; No. Pad (THT): 0; Category: Integrated Circuits (ICs); Topology: Flyback; Operating Temperature: -40°C ~ 85°C (TA); Package / Case: 8-SOIC (0.154", 3.90mm Width); Mounting Type: Surface Mount; Base Product Number: BM1P061; ComponentLink1Description: Digikey; ComponentLink1URL: https://www.digikey.com/en/products/detail/rohm-semiconductor/BM1P061FJ-E2/4625619?s=N4IgTCBcDaIEIFkCMAFADANiQMQFIgF0BfIA; Unit Price (Digikey): 1.59
XF1 = 696105003002: WR-FSH Fuseholder THT Blocks PCB Clip Cover; Manufacturer: Wurth Elektronik; Fuse Size: 5x20mm; No. Pad (SMD): 0; No. Pad (THT): 2; ComponentLink1Description: Manufacturer; ComponentLink1URL: http://www.we-online.de; ComponentLink2Description: Datasheet; ComponentLink2URL: https://www.we-online.com/catalog/datasheet/696105003002.pdf; Manufacturer Part Number: 696105003002; Published Date: March 2021; Operating Temperature: -30 to +120degC; Mounting Technology: THT; Packaging: Box; Unit Price (Digikey): 0.68

## Sheet Power_Supply.SchDoc
size A; SheetNumber: 8; SheetTotal: 8
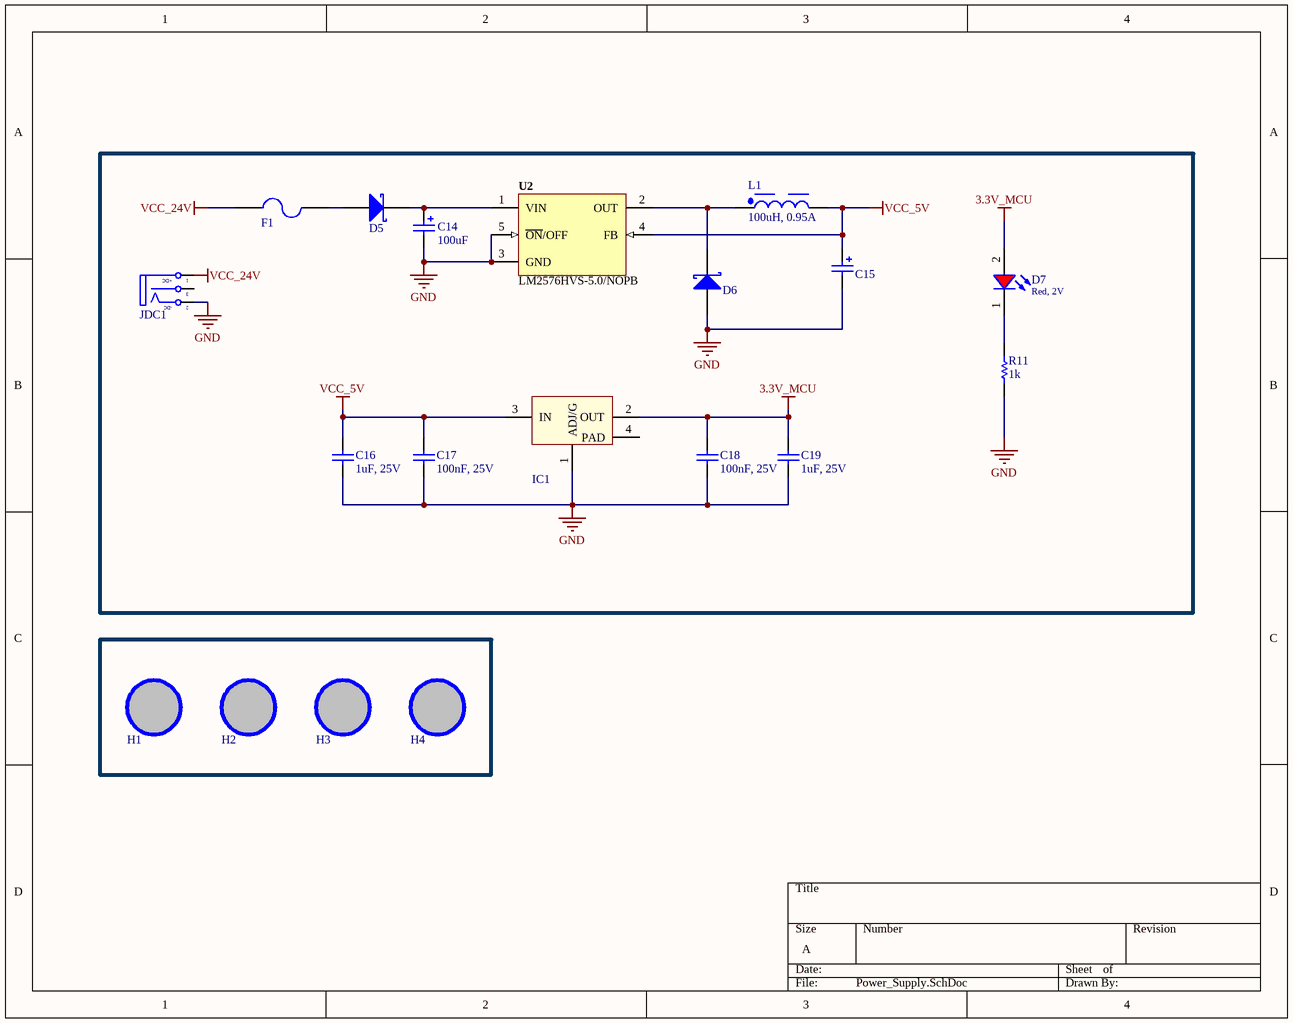
[diagram p7: Power_Supply.SchDoc]

### Parts
C14  100uF  [WCAP-ATG8_D8H11.5]
C15  1000uF  [WCAP-ATG8_D13H25]  (value not drawn)
C16  1uF, 25V  [WCAP-CSGP_0603_H=0.8mm_Reflow]
C17  100nF, 25V  [WCAP-CSGP_0603_H=0.8mm_Reflow]
C18  100nF, 25V  [WCAP-CSGP_0603_H=0.8mm_Reflow]
C19  1uF, 25V  [WCAP-CSGP_0603_H=0.8mm_Reflow]
D5  SS34  [SS34]  (value not drawn)
D6  SS34  [SS34]  (value not drawn)
D7  Red, 2V  [WL-SMCW_0603_H=0.7mm]
F1  0ZCG0150BF2C  [FUSE SMD]  (value not drawn)
H1  Hole  [LO KHOAN 3MM]  (value not drawn)  (no BOM)
H2  Hole  [LO KHOAN 3MM]  (value not drawn)  (no BOM)
H3  Hole  [LO KHOAN 3MM]  (value not drawn)  (no BOM)
H4  Hole  [LO KHOAN 3MM]  (value not drawn)  (no BOM)
IC1  LM1117IMP-3.3/NOPB  [SOT223-4N]  (value not drawn)
JDC1  G-014-4  [DC-IN]  (value not drawn)
L1  100uH, 0.95A  [WE-PD2SR_7850]
R11  value 1k  [RES-SM-0603]  (hidden comment: ESR03EZPJ102)
U2  LM2576HVS-5.0/NOPB  [TO263]

### Nets
3.3V_MCU: C18.2 C19.2 D7.2(A) IC1.2(OUT)
GND: C14.2(N) C15.2(N) C16.2 C17.1 C18.1 C19.1 D6.1(A) IC1.1(ADJ/G) JDC1.2(TN) R11.1 U2.3(GND) U2.5(~{ON}/OFF)
VCC_5V: C15.1(P) C16.1 C17.2 IC1.3(IN) L1.2 U2.4(FB)
VCC_24V: F1.1 JDC1.1(T)
NetC14_1: C14.1(P) D5.2(K) U2.1(VIN)
NetD5_1: D5.1(A) F1.2
NetD6_2: D6.2(K) L1.1 U2.2(OUT)
NetD7_1: D7.1(K) R11.2

Not connected (* = marked no-connect by the designer): H1 1; H2 1; H3 1; H4 1; IC1 4(PAD); JDC1 3(S)

### Library data of the parts
C14 = 860010674014: as C24 on sheet Power_Supply_AC_to_DC; ComponentLink1Description: Manufacturer Link; ComponentLink1URL: https://www.we-online.com/redexpert/article/860010674014?ad; ComponentLink2Description: Datasheet; ComponentLink2URL: https://www.we-online.com/redexpert/spec/860010674014?ad; Category: Aluminum Electrolytic Capacitors; Match Code: WCAP-ATG8; Manufacturer Part Number: 860010674014; Mount: Through Hole; Operating Temperature Max: 85°C; Operating Temperature Min: -40°C; Packaging: Ammo Pack; Height: 11.5mm; Diameter: 8mm; Capacitance: 100uF; Rated Voltage (DC): 50V; Unit Price (Digikey): 0.28
C15 = 860010678024: WCAP-ATG8 Aluminum Electrolytic Capacitor, Radial THT, D13xH25mm, 1000uF, 50V; Manufacturer: Wurth Elektronik; Capacitance Tolerance: +/-20%; Dissipation Factor: 10%; Endurance: 2000h; Leakage Current: 500uA; Ripple Current: 1485mA; Technical Reference: ATBI250102M050DSPACB000; No. Pad (SMD): 0; No. Pad (THT): 2; ComponentLink1Description: Manufacturer Link; ComponentLink1URL: https://www.we-online.com/redexpert/article/860010678024?ad; ComponentLink2Description: Datasheet; ComponentLink2URL: https://www.we-online.com/redexpert/spec/860010678024?ad; Category: Aluminum Electrolytic Capacitors; Match Code: WCAP-ATG8; Manufacturer Part Number: 860010678024; Mount: Through Hole; Operating Temperature Max: 85°C; Operating Temperature Min: -40°C; Packaging: Ammo Pack; Height: 25mm; Diameter: 13mm; Capacitance: 1000uF; Rated Voltage (DC): 50V; Unit Price (Digikey): 1.43
C16 C19 = 885012106022: WCAP-CSGP Multilayer Ceramic Chip Capacitor, General Purpose, size 0603, X5R, 1uF, 25V; Manufacturer: Wurth Elektronik; Rated Voltage: 25VDC; Isolation Resistance: >=0.5GOhm; Capacitance Tolerance: +/-20%; Technical Reference: X5R0603105M025DFCT10000; No. Pad (SMD): 2; No. Pad (THT): 0; ComponentLink1Description: Manufacturer; ComponentLink1URL: http://www.we-online.de; ComponentLink2Description: Datasheet; ComponentLink2URL: https://www.we-online.com/catalog/datasheet/885012106022.pdf; Operating Temperature: -55 to +85degC; Packaging: Tape and Reel; Manufacturer Part Number: 885012106022; Published Date: May 2020; Ceramic Type: X5R; Dissipation Factor: =<10%; Height: 0.8mm; Mounting Technology: SMT; Size: 0603; Capacitance: 1uF; Unit Price (Digikey): 0.43
C17 C18 = 885012206071: WCAP-CSGP Multilayer Ceramic Chip Capacitor, General Purpose, size 0603, X7R, 100nF, 25V; Manufacturer: Wurth Elektronik; Rated Voltage: 25VDC; Isolation Resistance: >=5GOhm; Capacitance Tolerance: +/-10%; Technical Reference: X7R0603104K025DFCT10000; No. Pad (SMD): 0; No. Pad (THT): 2; ComponentLink1Description: Manufacturer; ComponentLink1URL: http://www.we-online.de; ComponentLink2Description: Datasheet; ComponentLink2URL: https://www.we-online.com/catalog/datasheet/885012206071.pdf; Operating Temperature: -55 to +125degC; Packaging: Tape and Reel; Manufacturer Part Number: 885012206071; Published Date: May 2020; Ceramic Type: X7R; Dissipation Factor: =<3.5%; Height: 0.8mm; Mounting Technology: SMT; Size: 0603; Capacitance: 100nF; Unit Price (Digikey): 0.1
D5 D6 = D Schottky: DIODE SCHOTTKY 40V 3A SMC; Mfr: onsemi; Voltage - Forward (Vf) (Max) @ If: 500 mV @ 3 A; Speed: Fast Recovery =< 500ns, > 200mA (Io); Current - Reverse Leakage @ Vr: 500 µA @ 40 V; No. Pad (SMD): 2; No. Pad (THT): 0; Published: 8-Jun-2000; LatestRevisionDate: 17-Jul-2002; LatestRevisionNote: Re-released for DXP Platform.; PackageReference: SMB; Publisher: Altium Limited; PackageDescription: DO-214-AA/SMB; 2 C-Bend Leads; Body 5.3 x 3.6 mm, inc. leads (LxW); Code_JEDEC: DO-214-AA; Category: Discrete Semiconductor Products; Diode Type: Schottky; Voltage - DC Reverse (Vr) (Max): 40 V; Current - Average Rectified (Io): 3A; Mounting Type: Surface Mount; Package / Case: DO-214AB, SMC; Supplier Device Package: SMC (DO-214AB); Operating Temperature - Junction: -55°C ~ 150°C; Base Product Number: SS34; Unit Price (Digikey): 0.65
D7 = 150060RS75000: WL-SMCW SMT Mono-color Chip LED Waterclear, size 0603, Red, 2V, 140deg; Chip Technology: AlInGaP; Dominant Wavelength typ.: 625nm; Luminous Intensity typ.: 250mcd; Peak Wavelength typ.: 630nm; No. Pad (SMD): 2; No. Pad (THT): 0; Viewing Angle: 140deg; ComponentLink1Description: Manufacturer; ComponentLink1URL: http://www.we-online.de; ComponentLink2URL: https://www.we-online.com/catalog/datasheet/150060RS75000.pdf; ComponentLink2Description: Datasheet; Forward Voltage typ.: 2V; Emitting Color: Red; Mounting Technology: SMT; Operating Temperature: -40 to +85degC; Published Date: December 2019; Part Number: 150060RS75000; Packaging: Tape and Reel; Size: 0603; Publisher: Wurth Elektronik; Unit Price (Digikey): 0.15
F1 = Fuse: PTC RESET FUSE 24V 1.5A 1812; Mfr: Bel Fuse Inc.; Type: Polymeric; Current - Max: 100 A; Current - Trip (It): 3 A; Time to Trip: 1.5 s; Resistance - Initial (Ri) (Min): 40 mOhms; Resistance - Post Trip (R1) (Max): 120 mOhms; Approval Agency: AEC-Q200, cURus, TUV; No. Pad (SMD): 2; No. Pad (THT): 0; Category: Circuit Protection; Series: 0ZCG; Voltage - Max: 24V; ComponentLink1Description: Digikey; ComponentLink1URL: https://www.digikey.com/en/products/detail/bel-fuse-inc/0ZCG0150BF2C/4156109; Current - Hold (Ih) (Max): 1.5 A; Operating Temperature: -40°C ~ 85°C; Ratings: AEC-Q200; Mounting Type: Surface Mount; Package / Case: 1812 (4532 Metric), Concave; Size / DimensionParameter 2: 0.179" L x 0.128" W (4.55mm x 3.24mm); Thickness (Max): 0.061" (1.55mm); Unit Price (Digikey): 0.23
H1-H4 = Hole: Hole 3mm
IC1 = LM1117: IC REG LINEAR 3.3V 800MA SOT223; Mfr: Texas Instruments; Value: LM317; Output Configuration: Positive; Output Type: Fixed; Number of Regulators: 1; Voltage - Input (Max): 15V; Voltage Dropout (Max): 1.2V @ 800mA; Current - Quiescent (Iq): 5 mA; Current - Supply (Max): 10 mA; PSRR: 75dB (120Hz); Protection Features: Over Current, Over Temperature; No. Pad (SMD): 4; No. Pad (THT): 0; Category: Integrated Circuits (ICs); Series: LM1117-3.3; Voltage - Output (Min/Fixed): 3.3V; Current - Output: 800mA; Operating Temperature: -40°C ~ 125°C; Mounting Type: Surface Mount; Package / Case: TO-261-4, TO-261AA; Supplier Device Package: SOT-223; Base Product Number: LM1117; Unit Price (Digikey): 1.41
JDC1 = Jack DC: DC POWER JACK, MATES TO 5.5 X 2.; Mfr: GlobTek, Inc.; Value: Jac DC; Gender: Male; Industry Recognized Mating Diameter: 2.10mm ID (0.083"), 5.50mm OD (0.217"); Actual Diameter: 0.083" (2.10mm ID), 0.217" (5.50mm OD); Number of Positions/Contacts: 2 Conductors, 3 Contacts; Internal Switch(s): Single Switch; Shielding: Shielded; Voltage - Rated: 24VDC; Current Rating (Amps): 5 A; No. Pad (SMD): 0; No. Pad (THT): 3; Connector Type: Jack; Mounting Type: Through Hole, Right Angle; Termination: Kinked Pin, Solder; Insulation Color: Black; Contact Material - Plating: Nickel; Housing Material: Polybutylene Terephthalate (PBT), Glass Filled; Contact Material: Brass; Unit Price (Digikey): 1.02; ComponentLink1Description: Digikey; ComponentLink1URL: https://www.digikey.com/en/products/detail/globtek-inc/G-014-4/16515767?s=N4IgjCBcpgLFoDGUBmBDANgZwKYBoQB7KAbXAFZywAOAZhALEoCYB2eRl6iR62ANn4AGEAF0CABwAuUEAGUpAJwCWAOwDmIAL4FmATgQhkkdNnxFSIWqzBxWYyTMjylazTvB7y8aEdSZcAmJIMjBmWCE9EXEQaVkFFQ1tAgBaZkNjJQBXc2CycjEtD3SQkAApNEQAawACABEAYUKgA
L1 = 744787101: WE-PD2SR SMT Power Inductor, size 7850, 100uH, 0.95A, 467mOhm; Manufacturer: Wurth Elektronik; Self Resonant Frequency: 5MHz; DC Resistance typ.: 396mOhm; Saturation Current: 0.87A; No. Pad (SMD): 2; No. Pad (THT): 0; ComponentLink1Description: Manufacturer; ComponentLink1URL: http://www.we-online.de; ComponentLink2Description: Datasheet; ComponentLink2URL: https://www.we-online.com/catalog/datasheet/744787101.pdf; Mounting Technology: SMT; Operating Temperature: -40 to +125degC; Packaging: Tape and Reel; Height: 5mm; DC Resistance max.: 467mOhm; Inductance: 100uH; Manufacturer Part Number: 744787101; Rated Current: 0.95A; Size: 7850; Length: 7.8mm; Width: 7mm; Unit Price (Digikey): 1.95
R11 = RESISTOR SMD: RES SMD 1K OHM 5% 1/4W 0603; Mfr: Rohm Semiconductor; Resistance: 1 kOhms; Power (Watts): 0.25W, 1/4W; Temperature Coefficient: ±200ppm/°C; No. Pad (SMD): 2; No. Pad (THT): 0; Category: Resistors; Series: ESR; Tolerance: ±5%; Composition: Thick Film; Features: Automotive AEC-Q200, Pulse Withstanding; Operating Temperature: -55°C ~ 155°C; Package / Case: 0603 (1608 Metric); Supplier Device Package: 0603; Ratings: AEC-Q200; Size / Dimension: 0.063" L x 0.031" W (1.60mm x 0.80mm); Height - Seated (Max): 0.022" (0.55mm); Number of Terminations: 2; Unit Price (Digikey): 0.14; Parameter 13: *; Parameter 14: *
U2 = LM2576: IC REG BUCK 5V 3A TO263-5; Max Input Voltage: 12 V; Max Output Current: 3 (6.0 peak) A; Max Output Voltage: mV; No. Pad (SMD): 6; No. Pad (THT): 0; Category: IC-Power; Min Input Voltage: mV; Min Output Voltage: mV; Mounting Technology: Surface Mount; Status: Unreleased; Supply Voltage: mV; Temperature Range: -40 to +125 degC; Unit Price (Digikey): 9.24

## Nets that join several sheets
3.3V_MCU: MCU (17 pins), Power_Supply (C18.2 C19.2 D7.2 IC1.2)
GND: MCU (21 pins), Output (J8.2 J9.1 P2.4), Output_For_Relay (10 pins), Power_Supply_AC_to_DC (8 pins), Power_Supply (12 pins)
VCC_5V: Output (J8.1 P2.5), Power_Supply (6 pins)
VCC_24V: Output (J9.2), Output_For_Relay (5 pins), Power_Supply_AC_to_DC (5 pins), Power_Supply (F1.1 JDC1.1)
NetD8_2: MCU (U1.26), Output_For_Relay (D8.2 R12.2)
NetD9_2: MCU (U1.27), Output_For_Relay (D9.2 R13.2)
NetD10_2: MCU (U1.28), Output_For_Relay (D10.2 R16.2)
NetD11_2: MCU (U1.29), Output_For_Relay (D11.2 R17.2)
NetD12_2: MCU (U1.30), Output_For_Relay (D12.2 R18.2)
NetJ1_1: MCU (U1.16), Input (J1.1)
NetJ1_2: MCU (U1.17), Input (J1.2)
NetJ1_3: MCU (U1.18), Input (J1.3)
NetJ1_4: MCU (U1.19), Input (J1.4)
NetJ1_5: MCU (U1.20), Input (J1.5)
NetJ1_6: MCU (U1.21), Input (J1.6)
NetJ1_7: MCU (U1.22), Input (J1.7)
NetJ1_8: MCU (U1.25), Input (J1.8)
NetJ2_1: MCU (U1.45), Input (6 pins)
NetJ2_2: MCU (U1.10), Input (J2.2 R5.1)
NetJ3_2: MCU (U1.11), Input (J3.2 R6.1)
NetJ4_2: MCU (U1.12), Input (J4.2 R7.1)
NetJ5_2: MCU (U1.13), Input (J5.2 R8.1)
NetJ6_2: MCU (U1.14), Input (J6.2 R9.1)
NetJ7_2: MCU (U1.15), Input (J7.2 R10.1)
NetJ8_3: MCU (U1.35), Output (J8.3)
NetJ8_4: MCU (U1.36), Output (J8.4)
NetJ10_1: Output (J10.1), Output_For_Relay (LY1.5 LY1.6)
NetJ10_2: Output (J10.2), Output_For_Relay (LY1.3 LY1.4)
NetJ11_1: Output (J11.1), Output_For_Relay (LY2.5 LY2.6)
NetJ11_2: Output (J11.2), Output_For_Relay (LY2.3 LY2.4)
NetJ12_1: Output (J12.1), Output_For_Relay (LY3.5 LY3.6)
NetJ12_2: Output (J12.2), Output_For_Relay (LY3.3 LY3.4)
NetJ13_1: Output (J13.1), Output_For_Relay (LY4.5 LY4.6)
NetJ13_2: Output (J13.2), Output_For_Relay (LY4.3 LY4.4)
NetJ14_1: Output (J14.1), Output_For_Relay (LY5.5 LY5.6)
NetJ14_2: Output (J14.2), Output_For_Relay (LY5.3 LY5.4)
NetP2_1: MCU (U1.33), Output (P2.1)
NetP2_2: MCU (U1.32), Output (P2.2)
NetP2_3: MCU (U1.31), Output (P2.3)
NetR5_2: MCU (U1.46), Input (6 pins)